# EAGLE design DIP (EAGLE 5.11)
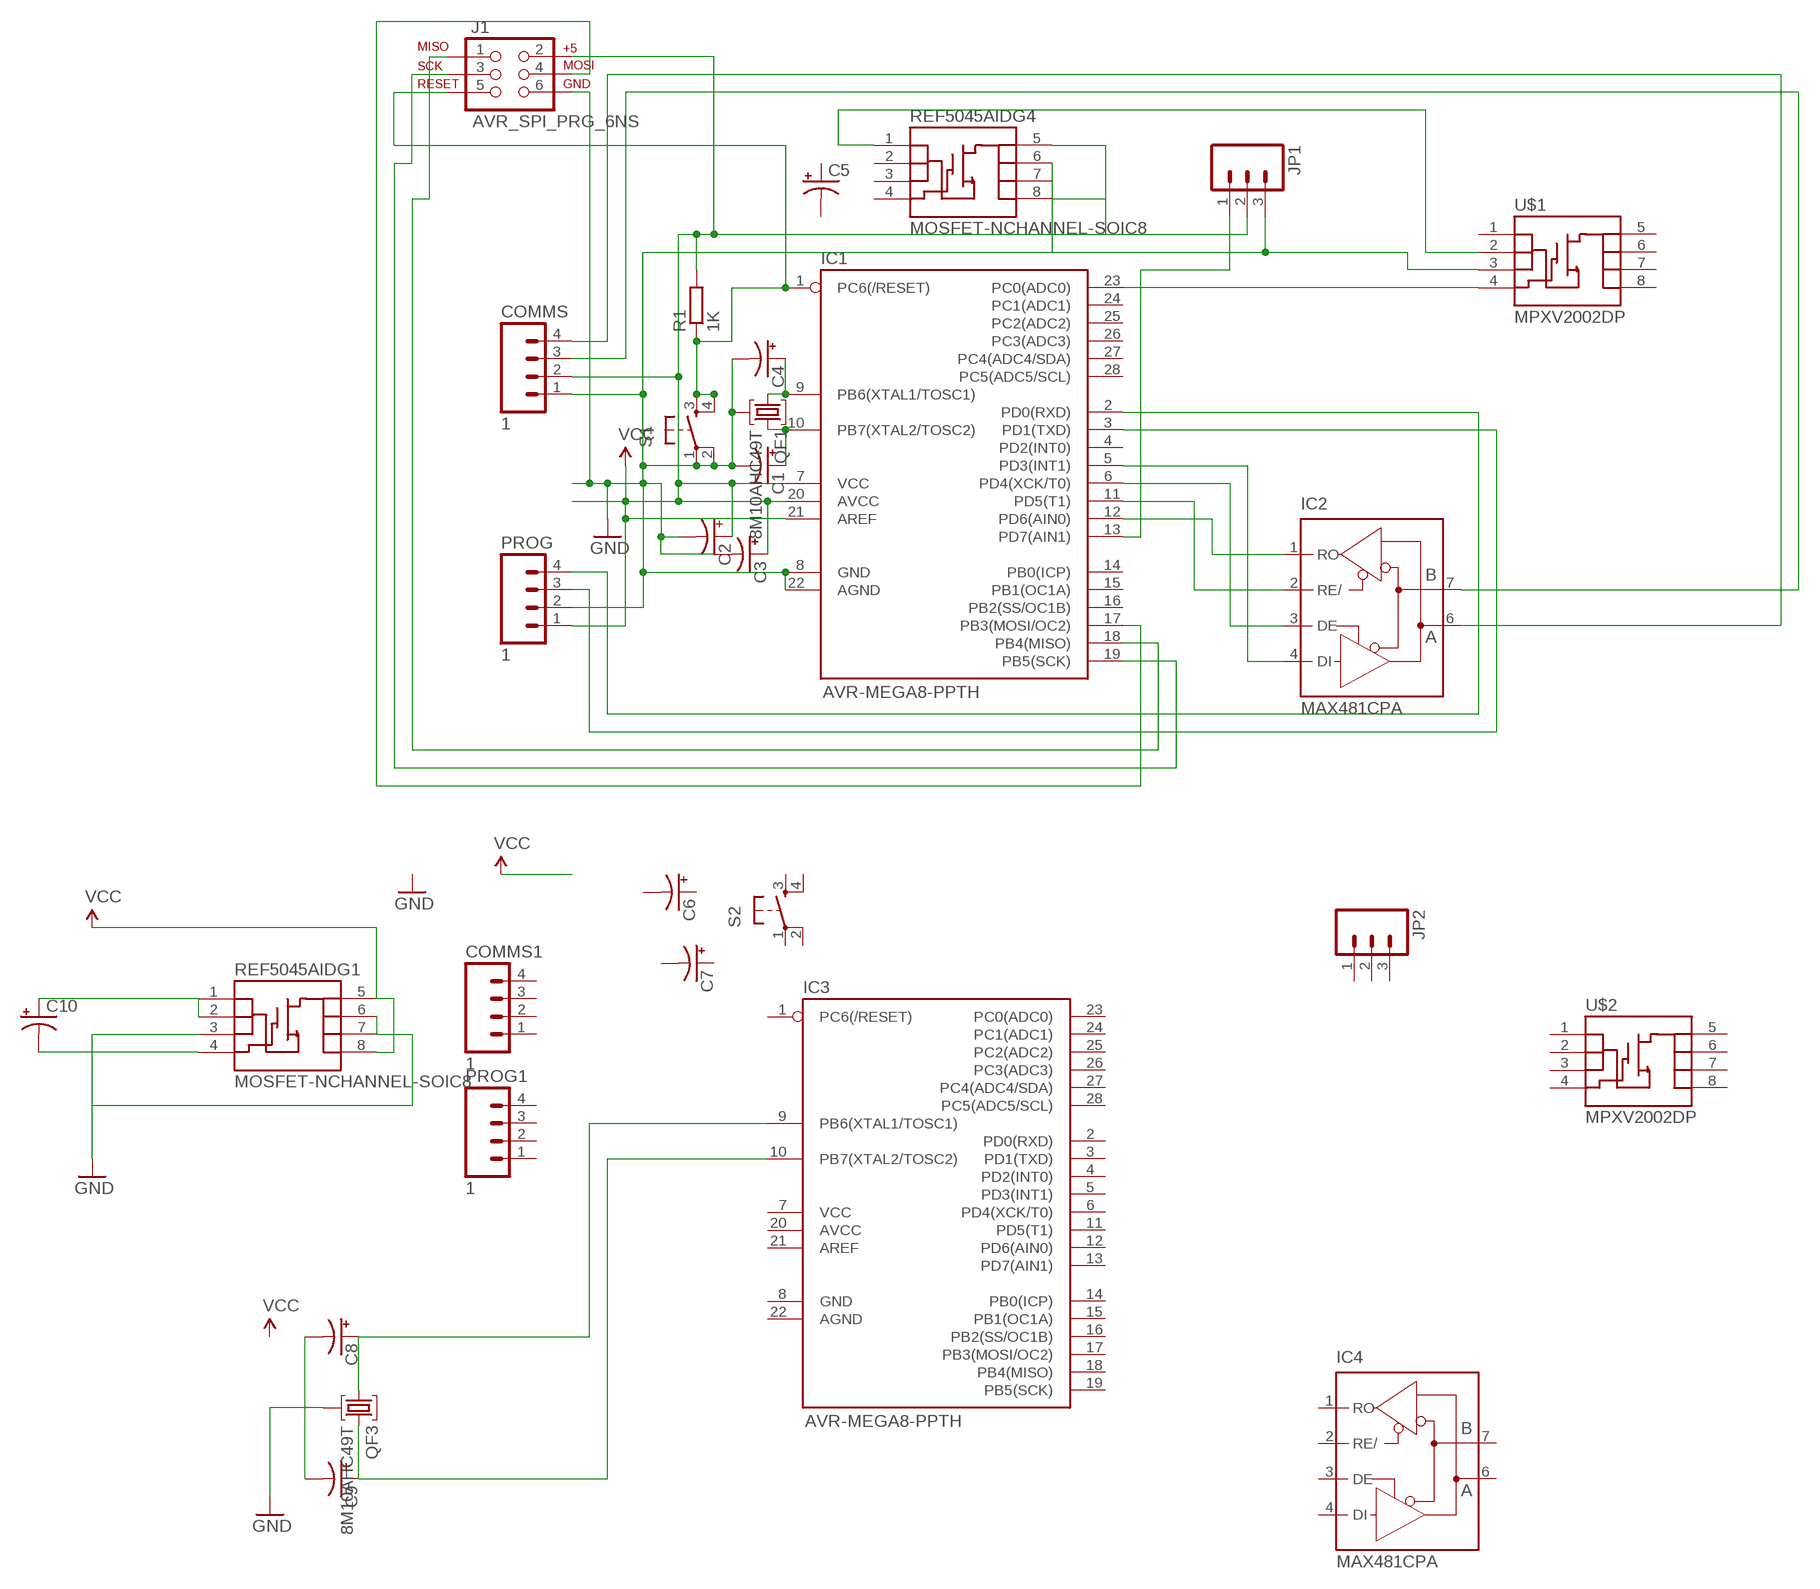
[diagram p0: schematic, sheet 1]

## Parts
C1  CAP_POL3528  [EIA3528]
C2  CAP_POL3528  [EIA3528]
C3  CAP_POL3528  [EIA3528]
C4  CAP_POL3528  [EIA3528]
C5  CAP_POL3528  [EIA3528]
C6  CAP_POL3528  [EIA3528]
C7  CAP_POL3528  [EIA3528]
C8  CAP_POL3528  [EIA3528]
C9  CAP_POL3528  [EIA3528]
C10  CAP_POL3528  [EIA3528]
COMMS  1  M04POLAR  [MOLEX-1X4]
COMMS1  1  M04POLAR  [MOLEX-1X4]
IC1  AVR-MEGA8-PPTH  [DIL28-3]
IC2  MAX481CPA  [DIL08]
IC3  AVR-MEGA8-PPTH  [DIL28-3]
IC4  MAX481CPA  [DIL08]
J1  AVR_SPI_PRG_6NS  [2X3-NS]
JP1  M03POLAR  [MOLEX-1X3]
JP2  M03POLAR  [MOLEX-1X3]
PROG  1  M04POLAR  [MOLEX-1X4]
PROG1  1  M04POLAR  [MOLEX-1X4]
QF1  8M10AHC49T  [HC49U]
QF3  8M10AHC49T  [HC49U]
R1  1K  R-EU_0204/7  [0204/7]
REF5045AIDG1  MOSFET-NCHANNEL-SOIC8  [SO08]
REF5045AIDG4  MOSFET-NCHANNEL-SOIC8  [SO08]
S1  TAC_SWITCHPTH  [TACTILE-PTH]
S2  TAC_SWITCHPTH  [TACTILE-PTH]
U$1  MPXV2002DP  MOSFET-NCHANNEL-SOIC8  [SO08]
U$2  MPXV2002DP  MOSFET-NCHANNEL-SOIC8  [SO08]

## Nets
GND: C1.C(-) C2.C(-) C3.C(-) C4.C(-) C8.C(-) C9.C(-) COMMS.1 IC1.8(GND) IC1.22(AGND) J1.6 JP1.3 PROG.2 QF1.2 QF3.2 REF5045AIDG1.3(S) REF5045AIDG1.6(D) REF5045AIDG1.7(D) REF5045AIDG4.6(D) REF5045AIDG4.7(D) S1.1 S1.2 U$1.3(S)
N$1: COMMS.3 IC2.7(B)
N$2: COMMS.4 IC2.6(A)
N$3: IC1.13(PD7(AIN1)) JP1.1
N$4: IC1.1(PC6(/RESET)) J1.5 R1.1 S1.3 S1.4
N$5: IC1.2(PD0(RXD)) PROG.4
N$6: IC1.23(PC0(ADC0)) U$1.4(G)
N$7: IC1.3(PD1(TXD)) PROG.3
N$8: IC1.12(PD6(AIN0)) IC2.1(RO)
N$9: IC1.11(PD5(T1)) IC2.2(RE/)
N$10: IC1.6(PD4(XCK/T0)) IC2.3(DE)
N$11: IC1.17(PB3(MOSI/OC2)) J1.4
N$12: C4.A(+) IC1.9(PB6(XTAL1/TOSC1)) QF1.1
N$13: IC1.18(PB4(MISO)) J1.1
N$14: IC1.19(PB5(SCK)) J1.3
N$15: C1.A(+) IC1.10(PB7(XTAL2/TOSC2)) QF1.3
N$16: IC1.5(PD3(INT1)) IC2.4(DI)
N$17: C8.A(+) IC3.9(PB6(XTAL1/TOSC1)) QF3.1
N$18: C9.A(+) IC3.10(PB7(XTAL2/TOSC2)) QF3.3
N$19: REF5045AIDG4.1(S) U$1.2(S)
N$23: C10.C(-) REF5045AIDG1.4(G)
N$24: C10.A(+) REF5045AIDG1.1(S) REF5045AIDG1.2(S)
VREF: C2.A(+) C3.A(+) COMMS.2 IC1.7(VCC) IC1.20(AVCC) IC1.21(AREF) J1.2 JP1.2 PROG.1 R1.2 REF5045AIDG1.5(D) REF5045AIDG1.8(D) REF5045AIDG4.5(D) REF5045AIDG4.8(D) ; supply symbol labelled VCC
Unconnected: C5.A(+) C5.C(-) C6.A(+) C6.C(-) C7.A(+) C7.C(-) COMMS1.1 COMMS1.2 COMMS1.3 COMMS1.4 IC1.4(PD2(INT0)) IC1.14(PB0(ICP)) IC1.15(PB1(OC1A)) IC1.16(PB2(SS/OC1B)) IC1.24(PC1(ADC1)) IC1.25(PC2(ADC2)) IC1.26(PC3(ADC3)) IC1.27(PC4(ADC4/SDA)) IC1.28(PC5(ADC5/SCL)) IC3.1(PC6(/RESET)) IC3.2(PD0(RXD)) IC3.3(PD1(TXD)) IC3.4(PD2(INT0)) IC3.5(PD3(INT1)) IC3.6(PD4(XCK/T0)) IC3.7(VCC) IC3.8(GND) IC3.11(PD5(T1)) IC3.12(PD6(AIN0)) IC3.13(PD7(AIN1)) IC3.14(PB0(ICP)) IC3.15(PB1(OC1A)) IC3.16(PB2(SS/OC1B)) IC3.17(PB3(MOSI/OC2)) IC3.18(PB4(MISO)) IC3.19(PB5(SCK)) IC3.20(AVCC) IC3.21(AREF) IC3.22(AGND) IC3.23(PC0(ADC0)) IC3.24(PC1(ADC1)) IC3.25(PC2(ADC2)) IC3.26(PC3(ADC3)) IC3.27(PC4(ADC4/SDA)) IC3.28(PC5(ADC5/SCL)) IC4.1(RO) IC4.2(RE/) IC4.3(DE) IC4.4(DI) IC4.6(A) IC4.7(B) JP2.1 JP2.2 JP2.3 PROG1.1 PROG1.2 PROG1.3 PROG1.4 REF5045AIDG4.2(S) REF5045AIDG4.3(S) REF5045AIDG4.4(G) S2.1 S2.2 S2.3 S2.4 U$1.1(S) U$1.5(D) U$1.6(D) U$1.7(D) U$1.8(D) U$2.1(S) U$2.2(S) U$2.3(S) U$2.4(G) U$2.5(D) U$2.6(D) U$2.7(D) U$2.8(D)

## Power pins joined to a net without a drawn wire
GND: IC2.5(GND) IC4.5(GND)
VREF: IC2.8(VCC) IC4.8(VCC)

## Library data of the parts
C1-C10 = SparkFun:CAP_POL: Capacitor Polarized These are standard SMD and PTH capacitors. Normally 10uF, 47uF, and 100uF in electrolytic and tantalum varieties. Always verify the external diameter of the through hole cap, it varies with capacity, voltage, and manufacturer. The EIA devices should be standard.
COMMS COMMS1 PROG PROG1 = SparkFun:M04: Header 4 Standard 4-pin 0.1" header. Use with straight break away headers (SKU : PRT-00116), right angle break away headers (PRT-00553), swiss pins (PRT-00743), machine pins (PRT-00117), and female headers (PRT-00115). Molex polarized connector foot print use with SKU : PRT-08231 with associated crimp pins and housings. 1MM SMD Version SKU: PRT-10208
IC1 IC3 = SparkFun:AVR-MEGA8-P: MICROCONTROLLER 8 Kbytes FLASH 1 kbytes SRAM 512 bytes EEPROM USART 4-channel 10 bit ADC 2-channel 8 bit ADC
IC2 IC4 = maxim:MAX481CPA: RS485 TRANSEIVER; MPN: MAX481CPA+; OC_FARNELL: unknown; OC_NEWARK: 99K3445
J1 = SparkFun:AVR_SPI_PRG_6: AVR ISP 6 Pin This is the reduced ISP connector for AVR programming. Common on Arduino. This footprint will take up less PCB space and can be used with a 10-pin to 6-pin adapter such as SKU: BOB-08508
JP1 JP2 = SparkFun:M03: Header 3 Standard 3-pin 0.1" header. Use with straight break away headers (SKU : PRT-00116), right angle break away headers (PRT-00553), swiss pins (PRT-00743), machine pins (PRT-00117), and female headers (PRT-00115). Molex polarized connector foot print use with SKU : PRT-08232 with associated crimp pins and housings.
QF1 QF3 = crystal:8M10AHC49T: Monolithic Crystal Filters Source: www.vanlong.com; OC_FARNELL: unknown; OC_NEWARK: unknown
R1 = resistor:R-EU_: RESISTOR, European symbol
REF5045AIDG1 REF5045AIDG4 U$1 U$2 = SparkFun:MOSFET-NCHANNEL-SOIC8: N-Channel MOSFET IRF9410 and NDS8434 are common, SOIC-8 parts.
S1 S2 = SparkFun:TAC_SWITCH: Momentary Switch Button commonly used for reset or general input. Spark Fun Electronics SKU : COM-00097

## Board
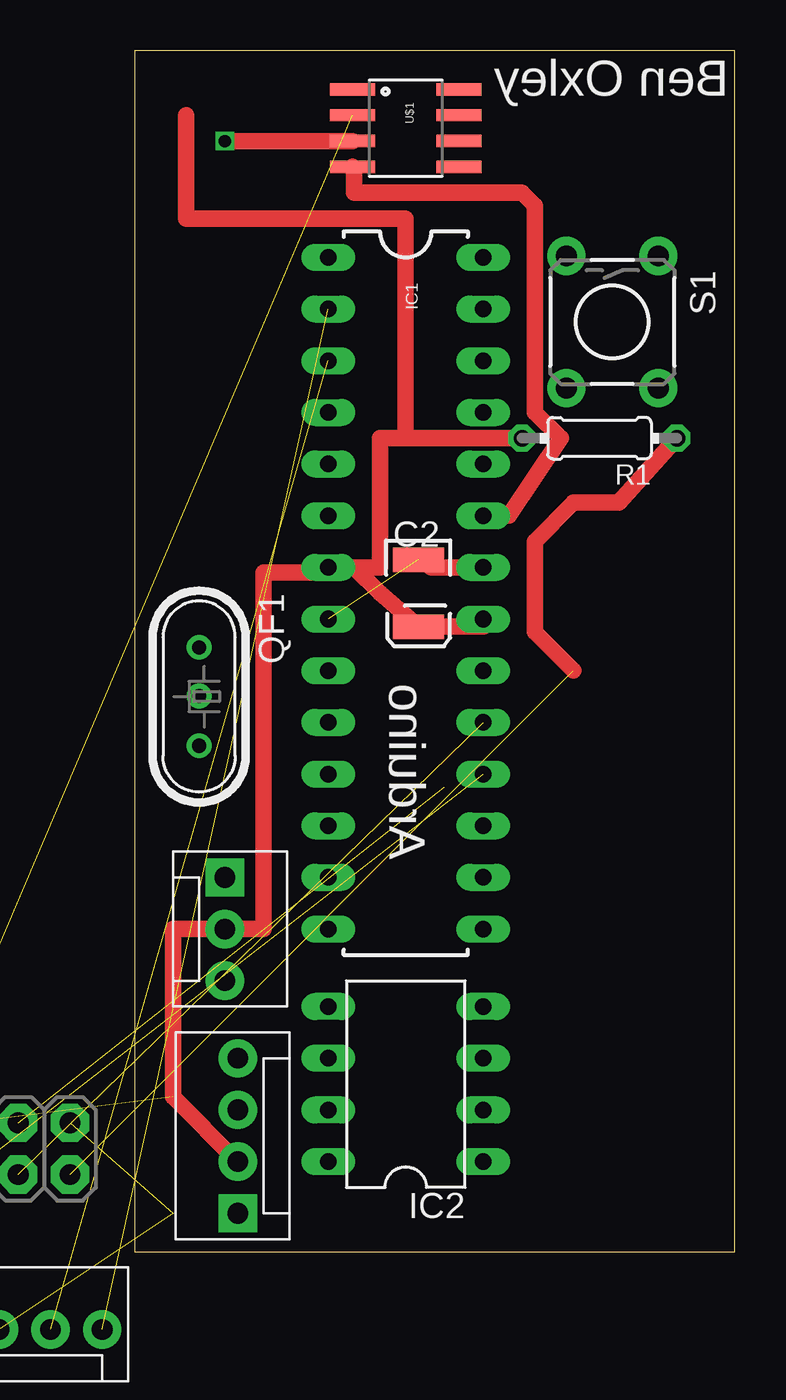
[diagram p1: board, top side]
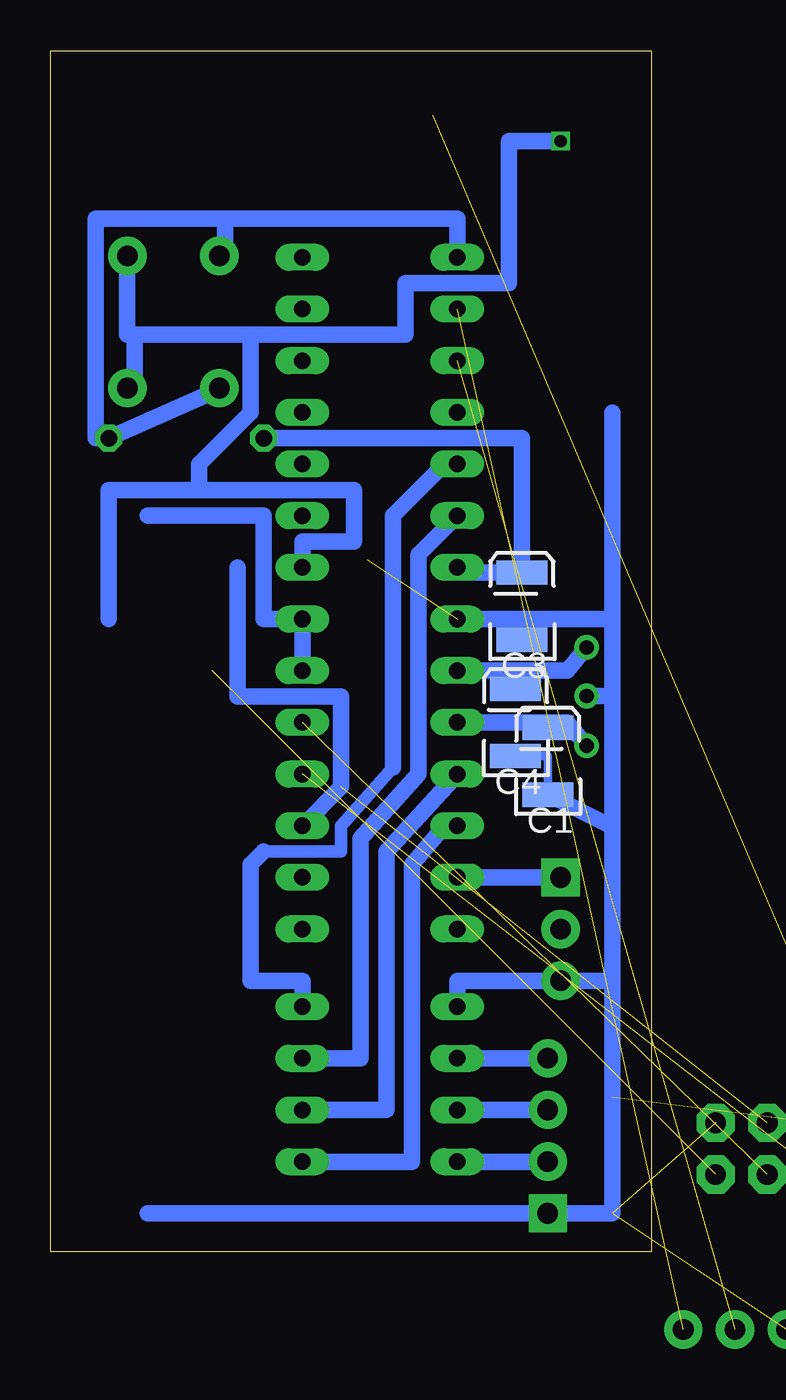
[diagram p2: board, bottom side, seen from below]

Size 29.51 x 59.05 mm. Coordinates in mm from the lower left corner, seen from the top.
Outline: 0,0 29.51,0 29.51,59.05 0,59.05 0,0
Copper layers (1*16): Top 0.035mm / dielectric 1.5mm / Bottom 0.035mm
Design rules "Fusion_eagle_rule_v1.1": minimum track width 6mil, minimum drill 12mil, track to track 6mil, track to pad 6mil, pad to pad 6mil, via to via 6mil, smd to smd 0mil, copper to edge 10mil, drill to drill 10mil, minimum pad ring 10mil, minimum via ring 6mil, stop-mask expansion 2mil, vias tented up to drill 100mil, thermal gap 10mil

### Footprints (pad centres in the part's own frame; a part is rotated, then mirrored left to right if it is on the bottom)
EIA3528 = smd 1.2 x 2.5: A 1.65,0; C -1.65,0
MOLEX-1X4 = drill 1.016 pad 1.88 square: 1 0,0 | drill 1.016 pad 1.88 round: 2 2.54,0; 3 5.08,0; 4 7.62,0
DIL28-3 = drill 0.813 long: 1 -16.51,-3.81; 2 -13.97,-3.81; 3 -11.43,-3.81; 4 -8.89,-3.81; 5 -6.35,-3.81; 6 -3.81,-3.81; 7 -1.27,-3.81; 8 1.27,-3.81; 9 3.81,-3.81; 10 6.35,-3.81; 11 8.89,-3.81; 12 11.43,-3.81; 13 13.97,-3.81; 14 16.51,-3.81; 15 16.51,3.81; 16 13.97,3.81; 17 11.43,3.81; 18 8.89,3.81; 19 6.35,3.81; 20 3.81,3.81; 21 1.27,3.81; 22 -1.27,3.81; 23 -3.81,3.81; 24 -6.35,3.81; 25 -8.89,3.81; 26 -11.43,3.81; 27 -13.97,3.81; 28 -16.51,3.81
DIL08 = drill 0.813 long: 1 -3.81,-3.81; 2 -1.27,-3.81; 3 1.27,-3.81; 4 3.81,-3.81; 5 3.81,3.81; 6 1.27,3.81; 7 -1.27,3.81; 8 -3.81,3.81
2X3-NS = drill 1.016 pad 1.88 square: 1 -2.54,-1.27 | drill 1.016 pad 1.88 octagon: 2 -2.54,1.27; 3 0,-1.27; 4 0,1.27; 5 2.54,-1.27; 6 2.54,1.27
MOLEX-1X3 = drill 1.016 pad 1.88 square: 1 0,0 | drill 1.016 pad 1.88 round: 2 2.54,0; 3 5.08,0
HC49U = drill 0.7 pad 1.2 round: 1 -2.413,0; 2 -0.027,0; 3 2.413,0
0204/7 = drill 0.813 octagon: 1 -3.81,0; 2 3.81,0
SO08 = smd 0.61 x 2.21: 1 -1.905,-2.616; 2 -0.635,-2.616; 3 0.635,-2.616; 4 1.905,-2.616; 5 1.905,2.616; 6 0.635,2.616; 7 -0.635,2.616; 8 -1.905,2.616
TACTILE-PTH = drill 1.016 pad 1.88 round: 1 -3.251,2.261; 2 3.251,2.261; 3 -3.251,-2.261; 4 3.251,-2.261

### Placement (x,y rotation side)
C1  5.08,24.13 90 bottom
C2  13.97,32.38 270 top
C3  6.35,31.75 90 bottom
C4  6.67,26.03 90 bottom
C5  -12.7,-9.21 0 top  (outside the outline)
C6  -14.29,-74.3 0 top  (outside the outline)
C7  -14.29,-78.42 0 top  (outside the outline)
C8  -23.5,-102.87 0 top  (outside the outline)
C9  -23.5,-107 0 top  (outside the outline)
C10  -23.5,-111.12 0 top  (outside the outline)
COMMS  5.08,1.91 90 top
COMMS1  -16.83,-62.55 0 top  (outside the outline)
IC1  13.34,32.38 270 top
IC2  13.34,8.25 90 top
IC3  1.27,-17.78 0 top  (outside the outline)
IC4  -11.11,-52.7 0 top  (outside the outline)
J1  -5.71,5.08 0 top  (outside the outline)
JP1  4.45,18.41 270 top
JP2  -16.51,-43.5 0 top  (outside the outline)
PROG  -9.21,-3.81 0 top  (outside the outline)
PROG1  -16.83,-69.22 0 top  (outside the outline)
QF1  3.18,27.3 270 top
QF3  -21.91,-96.2 0 top  (outside the outline)
R1  22.86,40.01 180 top
REF5045AIDG1  -14.29,-28.26 0 top  (outside the outline)
REF5045AIDG4  -13.65,-3.18 0 top  (outside the outline)
S1  23.5,45.72 270 top
S2  -22.86,-77.47 0 top  (outside the outline)
U$1  13.34,55.25 270 top
U$2  -14.92,-36.2 0 top  (outside the outline)

### Tracks (layer width: path | path; a pad name or v marks a point on that pad's centre or on a via)
GND  (via drill 0.6)  (12 unrouted)
  Top 0.813: C2.C 14.61,33.66 IC1.22 | v4.45,54.61 U$1.3
  Bottom 0.406: C4.C 5.08,24.38 C1.C
  Bottom 0.813: IC1.22 17.14,34.92 14.61,34.92 14.61,37.47 22.23,37.47 | 22.23,37.47 26.67,37.47 26.67,31.12 | 6.35,31.12 C3.C | 1.91,27.33 1.91,31.12 | 1.91,31.12 6.35,31.12 | 1.91,27.33 QF1.2 | 1.91,13.34 JP1.3 9.53,13.34 IC2.5 | 1.91,13.34 1.91,1.91 COMMS.1 24.77,1.91 | S1.2 25.4,42.47 25.4,45.09 | 19.68,45.09 25.4,45.09 | 19.68,45.09 19.68,41.27 22.23,38.73 22.23,37.47 | 25.4,45.09 25.76,45.09 S1.1 | 1.91,31.12 1.91,41.27 | 6.35,31.12 IC1.8 | 1.91,13.34 1.91,20.89 | 1.91,20.89 1.91,27.33 | 19.68,45.09 12.07,45.09 12.07,47.62 6.98,47.62 6.98,54.61 v4.45,54.61 | 1.91,20.89 C1.C
N$1
  Bottom 0.813: IC2.7 COMMS.3
N$2
  Bottom 0.813: IC2.6 COMMS.4
N$3
  Bottom 0.813: IC1.13 JP1.1
N$4  (1 unrouted)
  Top 0.813: R1.1 23.81,36.83 21.59,36.83 19.68,34.92 19.68,30.48 21.59,28.58
  Bottom 0.813: S1.4 21.59,42.47 20.96,42.55 R1.1 27.31,40.01 27.31,50.8 20.96,50.8 | S1.3 20.96,48.97 20.96,50.8 | 20.96,50.8 9.53,50.8 IC1.1
N$5  (1 unrouted)
N$6
  Top 0.813: IC1.23 18.41,36.2 20.96,40.01 19.68,41.27 19.68,51.44 19.05,52.07 10.8,52.07 10.8,53.26 U$1.4
N$7  (1 unrouted)
N$8
  Bottom 0.813: IC2.1 11.75,4.45 11.75,19.05 10.16,20.95 IC1.12
N$9
  Bottom 0.813: IC2.2 13.02,6.98 13.02,19.69 IC1.11
N$10
  Bottom 0.813: IC2.3 14.29,9.52 14.29,20.32 11.43,23.49 11.43,34.29 IC1.6
N$11  (1 unrouted)
  Bottom 0.813: 20.32,33.66 20.32,27.3 15.24,27.3 15.24,22.86 IC1.17
N$12
  Bottom 0.406: 6.98,28.58 C4.A
  Bottom 0.813: 3.18,29.84 QF1.1 4.13,28.58 6.98,28.58 IC1.9
N$13  (1 unrouted)
N$14  (1 unrouted)
N$15
  Bottom 0.406: 5.08,26.03 C1.A
  Bottom 0.813: QF1.3 4.13,26.03 5.08,26.03 IC1.10
N$16
  Bottom 0.61: 19.05,19.69 15.24,19.69 15.24,20.95 12.7,23.81
  Bottom 0.813: IC2.4 17.14,13.34 19.68,13.34 19.68,19.05 19.05,19.69 | 12.7,23.81 12.7,36.2 10.16,38.73 IC1.5
N$17  (2 unrouted)
N$18  (2 unrouted)
N$19  (1 unrouted)
N$23  (1 unrouted)
N$24  (2 unrouted)
VREF  (7 unrouted)
  Top 0.813: IC1.21 17.14,30.73 C2.A 13.91,30.8 12.07,32.38 10.8,33.66 IC1.7 | COMMS.2 1.91,7.62 1.91,15.88 JP1.2 6.35,15.88 C3.A 9.27,33.4 IC1.7 | 13.34,40.01 12.07,40.01 12.07,33.66 IC1.7 | R1.2 13.34,40.01 | 2.54,55.88 2.54,50.8 13.34,50.8 13.34,40.01
  Bottom 0.813: 24.77,36.2 19.05,36.2 19.05,31.12 IC1.21 IC1.20 | IC1.7 9.53,33.4 C3.A 6.35,38.73 6.35,40.01 R1.2 | COMMS.2 IC2.8

### Text on the board
_tsilk: Ben Oxley | Arduino